# Altium schematic sheet 1206_array.SchDoc
size 594 x 420 mm; Address1: Address1; Address2: Address2; Address3: Address3; Address4: Address4; DocumentNumber: АБВГ.123456.001 Э3; SheetNumber: 1; SheetTotal: 3; Scale: 1:1; DocumentType: Схема электрическая принципиальная; FirstReferrence: АБВГ.123456.001
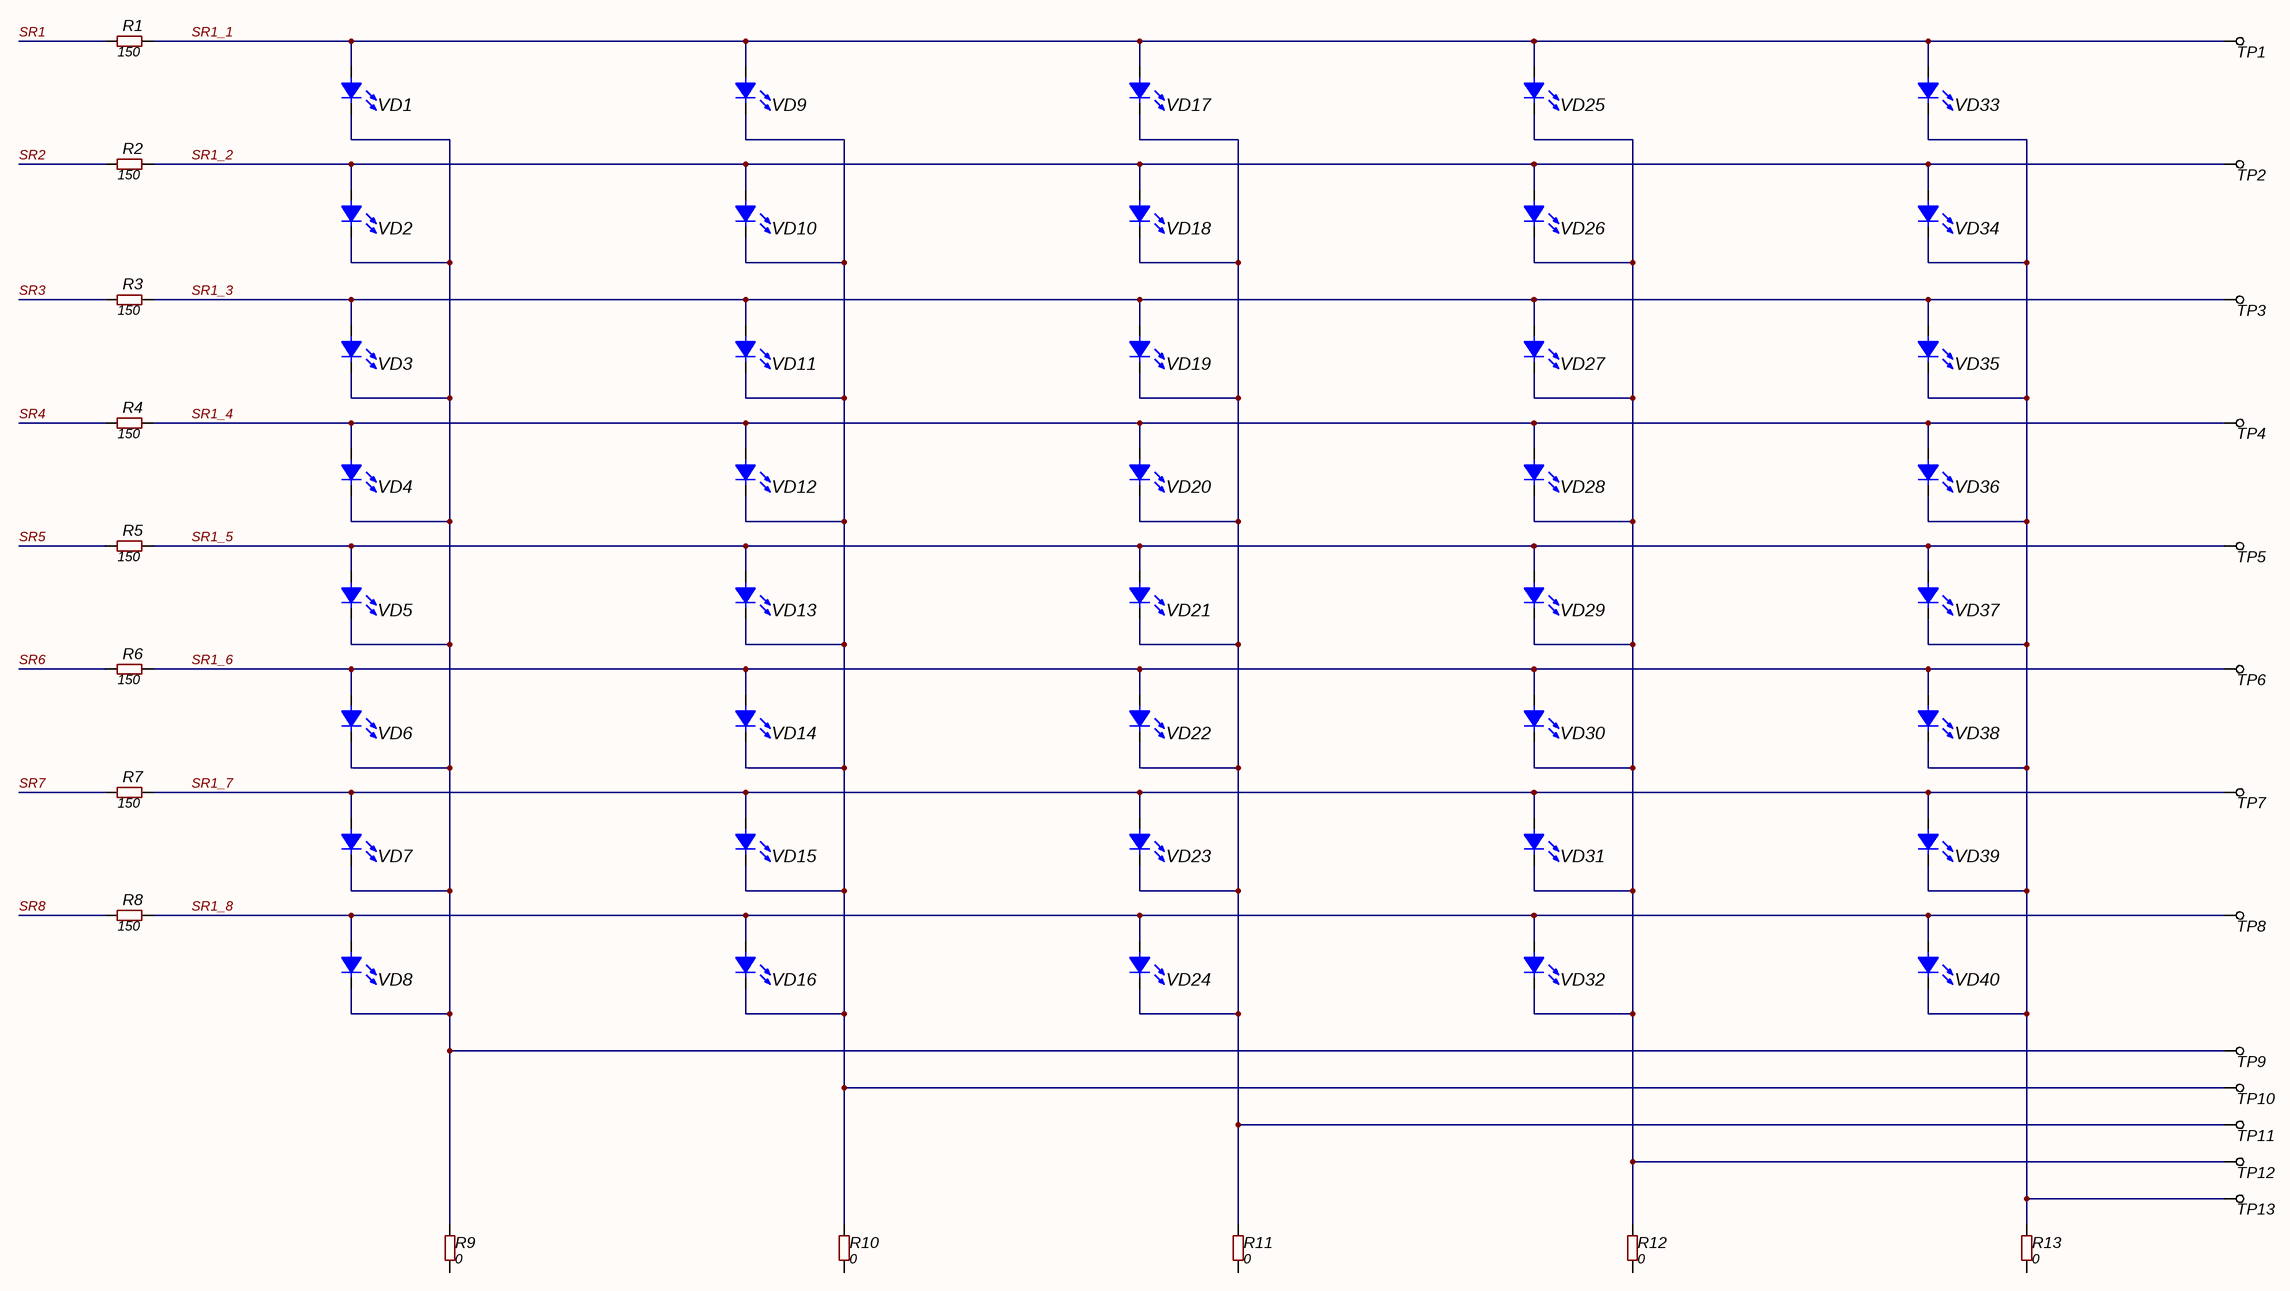
[diagram p0: 1206_array.SchDoc]

## Parts
R1  value 150  [RES: 0603]
R2  value 150  [RES: 0603]
R3  value 150  [RES: 0603]
R4  value 150  [RES: 0603]
R5  value 150  [RES: 0603]
R6  value 150  [RES: 0603]
R7  value 150  [RES: 0603]
R8  value 150  [RES: 0603]
R9  value 0  [RES: 0603]
R10  value 0  [RES: 0603]
R11  value 0  [RES: 0603]
R12  value 0  [RES: 0603]
R13  value 0  [RES: 0603]
TP1  Testpoint_HS1mm  [TestPoint(without 3D)]  (value not drawn)
TP2  Testpoint_HS1mm  [TestPoint(without 3D)]  (value not drawn)
TP3  Testpoint_HS1mm  [TestPoint(without 3D)]  (value not drawn)
TP4  Testpoint_HS1mm  [TestPoint(without 3D)]  (value not drawn)
TP5  Testpoint_HS1mm  [TestPoint(without 3D)]  (value not drawn)
TP6  Testpoint_HS1mm  [TestPoint(without 3D)]  (value not drawn)
TP7  Testpoint_HS1mm  [TestPoint(without 3D)]  (value not drawn)
TP8  Testpoint_HS1mm  [TestPoint(without 3D)]  (value not drawn)
TP9  Testpoint_HS1mm  [TestPoint(without 3D)]  (value not drawn)
TP10  Testpoint_HS1mm  [TestPoint(without 3D)]  (value not drawn)
TP11  Testpoint_HS1mm  [TestPoint(without 3D)]  (value not drawn)
TP12  Testpoint_HS1mm  [TestPoint(without 3D)]  (value not drawn)
TP13  Testpoint_HS1mm  [TestPoint(without 3D)]  (value not drawn)
VD1  (no value)  [LED: 1206Y]
VD2  (no value)  [LED: 1206Y]
VD3  (no value)  [LED: 1206Y]
VD4  (no value)  [LED: 1206Y]
VD5  (no value)  [LED: 1206Y]
VD6  (no value)  [LED: 1206Y]
VD7  (no value)  [LED: 1206Y]
VD8  (no value)  [LED: 1206Y]
VD9  (no value)  [LED: 1206Y]
VD10  (no value)  [LED: 1206Y]
VD11  (no value)  [LED: 1206Y]
VD12  (no value)  [LED: 1206Y]
VD13  (no value)  [LED: 1206Y]
VD14  (no value)  [LED: 1206Y]
VD15  (no value)  [LED: 1206Y]
VD16  (no value)  [LED: 1206Y]
VD17  (no value)  [LED: 1206Y]
VD18  (no value)  [LED: 1206Y]
VD19  (no value)  [LED: 1206Y]
VD20  (no value)  [LED: 1206Y]
VD21  (no value)  [LED: 1206Y]
VD22  (no value)  [LED: 1206Y]
VD23  (no value)  [LED: 1206Y]
VD24  (no value)  [LED: 1206Y]
VD25  (no value)  [LED: 1206Y]
VD26  (no value)  [LED: 1206Y]
VD27  (no value)  [LED: 1206Y]
VD28  (no value)  [LED: 1206Y]
VD29  (no value)  [LED: 1206Y]
VD30  (no value)  [LED: 1206Y]
VD31  (no value)  [LED: 1206Y]
VD32  (no value)  [LED: 1206Y]
VD33  (no value)  [LED: 1206Y]
VD34  (no value)  [LED: 1206Y]
VD35  (no value)  [LED: 1206Y]
VD36  (no value)  [LED: 1206Y]
VD37  (no value)  [LED: 1206Y]
VD38  (no value)  [LED: 1206Y]
VD39  (no value)  [LED: 1206Y]
VD40  (no value)  [LED: 1206Y]

## Nets
SR1: R1.1
SR1_1: R1.2 TP1.1 VD1.1(A) VD9.1(A) VD17.1(A) VD25.1(A) VD33.1(A)
SR1_2: R2.2 TP2.1 VD2.1(A) VD10.1(A) VD18.1(A) VD26.1(A) VD34.1(A)
SR1_3: R3.2 TP3.1 VD3.1(A) VD11.1(A) VD19.1(A) VD27.1(A) VD35.1(A)
SR1_4: R4.2 TP4.1 VD4.1(A) VD12.1(A) VD20.1(A) VD28.1(A) VD36.1(A)
SR1_5: R5.2 TP5.1 VD5.1(A) VD13.1(A) VD21.1(A) VD29.1(A) VD37.1(A)
SR1_6: R6.2 TP6.1 VD6.1(A) VD14.1(A) VD22.1(A) VD30.1(A) VD38.1(A)
SR1_7: R7.2 TP7.1 VD7.1(A) VD15.1(A) VD23.1(A) VD31.1(A) VD39.1(A)
SR1_8: R8.2 TP8.1 VD8.1(A) VD16.1(A) VD24.1(A) VD32.1(A) VD40.1(A)
SR2: R2.1
SR3: R3.1
SR4: R4.1
SR5: R5.1
SR6: R6.1
SR7: R7.1
SR8: R8.1
NetR9_2: R9.2 TP9.1 VD1.2(C) VD2.2(C) VD3.2(C) VD4.2(C) VD5.2(C) VD6.2(C) VD7.2(C) VD8.2(C)
NetR10_2: R10.2 TP10.1 VD9.2(C) VD10.2(C) VD11.2(C) VD12.2(C) VD13.2(C) VD14.2(C) VD15.2(C) VD16.2(C)
NetR11_2: R11.2 TP11.1 VD17.2(C) VD18.2(C) VD19.2(C) VD20.2(C) VD21.2(C) VD22.2(C) VD23.2(C) VD24.2(C)
NetR12_2: R12.2 TP12.1 VD25.2(C) VD26.2(C) VD27.2(C) VD28.2(C) VD29.2(C) VD30.2(C) VD31.2(C) VD32.2(C)
NetR13_2: R13.2 TP13.1 VD33.2(C) VD34.2(C) VD35.2(C) VD36.2(C) VD37.2(C) VD38.2(C) VD39.2(C) VD40.2(C)

Not connected (* = marked no-connect by the designer): R9 1; R10 1; R11 1; R12 1; R13 1

## Notes on the sheet
- Перв. примен.
- Справ. №
- Подп. и дата
- Инв. № дубл.
- Взам. инв. №
- Разраб.
- Изм.
- Лист
- № докум.
- Подп.
- Дата
- Лит.
- Масса
- Масштаб
- Пров.
- Т.контр.
- Листов
- Инв. № подл.
- Утв.
- Н.контр.
- 2.106-A2
- Копировал
- Формат А2

## Library data of the parts
R1-R13 = Resistor_0603: Manufacturer: Yageo; PartNumber: RC0603JR-07100RL; TypeResistor: Resistor film; Power: 0.1W; Package: 0603; HelpURL: https://www.digikey.com/product-detail/en/yageo/RC0603JR-07100RL/311-100GRCT-ND/729644; ValueManufacturerPartNumber: =TypeResistor+', '+Value+', '+Tolerance+', '+Package+', '+Power+', '+Temperature; Temperature: -55...+125°C
VD1-VD40 = LED_single: ValueManufacturerPartNumber: LED, Green, *, *, *, -55...+150°C; TypeDiode: LED; ColorParameter: Green; Manufacturer: *; Package: *; HelpURL: *; Temperature: -55...+150°C; Current: *; VoltageDrop: *; PartNumber: *; Color: GREEN